# Altium schematic sheet EPS_VBAT_EMI-Filter.SchDoc: VBAT / EMI Filter
size A4; Date: 2015-10-11; Author: Piotr Kuligowski; Revision: 1-0; SheetNumber: 38; SheetTotal: 51; Model: EM1
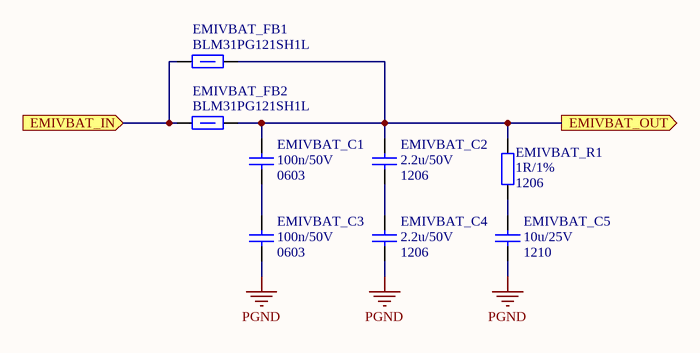
[diagram p0: EPS_VBAT_EMI-Filter.SchDoc]

## Parts
EMIVBAT_C1  Package: 0603  [SMD_Capacitor_0603]  (hidden comment: 100n/50V)
EMIVBAT_C2  Package: 1206  [SMD_Capacitor_1206]  (hidden comment: 2.2u/50V)
EMIVBAT_C3  Package: 0603  [SMD_Capacitor_0603]  (hidden comment: 100n/50V)
EMIVBAT_C4  Package: 1206  [SMD_Capacitor_1206]  (hidden comment: 2.2u/50V)
EMIVBAT_C5  Package: 1210  [SMD_Capacitor_1210]  (hidden comment: 10u/25V)
EMIVBAT_FB1  120R/100MHz  [SMD_FerriteBead_1206]  (value not drawn)
EMIVBAT_FB2  120R/100MHz  [SMD_FerriteBead_1206]  (value not drawn)
EMIVBAT_R1  Package: 1206  [SMD_Resistor_1206]  (hidden comment: 1R/1%)

## Ports
EMIVBAT_IN (in), EMIVBAT_OUT (out)

## Nets
PGND: EMIVBAT_C3.2 EMIVBAT_C4.2 EMIVBAT_C5.2
EMIVBAT_IN: EMIVBAT_FB1.2 EMIVBAT_FB2.2 ; port EMIVBAT_IN
EMIVBAT_OUT: EMIVBAT_C1.1 EMIVBAT_C2.1 EMIVBAT_FB1.1 EMIVBAT_FB2.1 EMIVBAT_R1.1 ; port EMIVBAT_OUT
NetEMIVBAT_C1_2: EMIVBAT_C1.2 EMIVBAT_C3.1
NetEMIVBAT_C2_2: EMIVBAT_C2.2 EMIVBAT_C4.1
NetEMIVBAT_C5_1: EMIVBAT_C5.1 EMIVBAT_R1.2

## Notes on the sheet
- Title:
- Project:
- Author:
- Model:
- Document Number:
- Checked by:
- Rev:
- Date:
- Approved by:
- Sheet:
- of
- File name:

## Library data of the parts
EMIVBAT_C1 EMIVBAT_C3 = Cer_C0603T104K5RALTU: Ceramic Cap Kemet COTS 100n/50V X7R 0603; Manufacturer: Kemet; ManufacturerPartNumber: C0603T104K5RALTU; Value: 100n/50V
EMIVBAT_C2 EMIVBAT_C4 = Cer_GCJ31CR71H225KA12L: Ceramic Cap Murata Automotive 2.2u/50V X7R 1206; Manufacturer: Murata; ManufacturerPartNumber: GCJ31CR71H225KA12L; Value: 2.2u/50V
EMIVBAT_C5 = Cer_GCJ32ER71E106KA12L: Ceramic Cap Murata Automotive 10u/25V X7R 1210; Manufacturer: Murata; ManufacturerPartNumber: GCJ32ER71E106KA12L; Value: 10u/25V
EMIVBAT_FB1 EMIVBAT_FB2 = BLM31PG121SH1L: Ferrite bead, 1206, 0.02HM, 3.5A.; Manufacturer: Murata; Current Rating: 3.5A; Series Resistance DC: 0.02R; Package: 1206; Value: 120R/100MHz; ManufacturerPartNumber: BLM31PG121SH1L
EMIVBAT_R1 = CRCW12061R00FKxxxx: 1R/1% Vishay CRCW 1206 Resistor. 250mW, 100ppm, 200V.; ManufacturerPartNumber: CRCW12061R00FKxxxx; Manufacturer: Vishay; Value: 1R/1%